# Altium schematic sheet Schematic.SchDoc
size A4; SheetNumber: 1; SheetTotal: 1
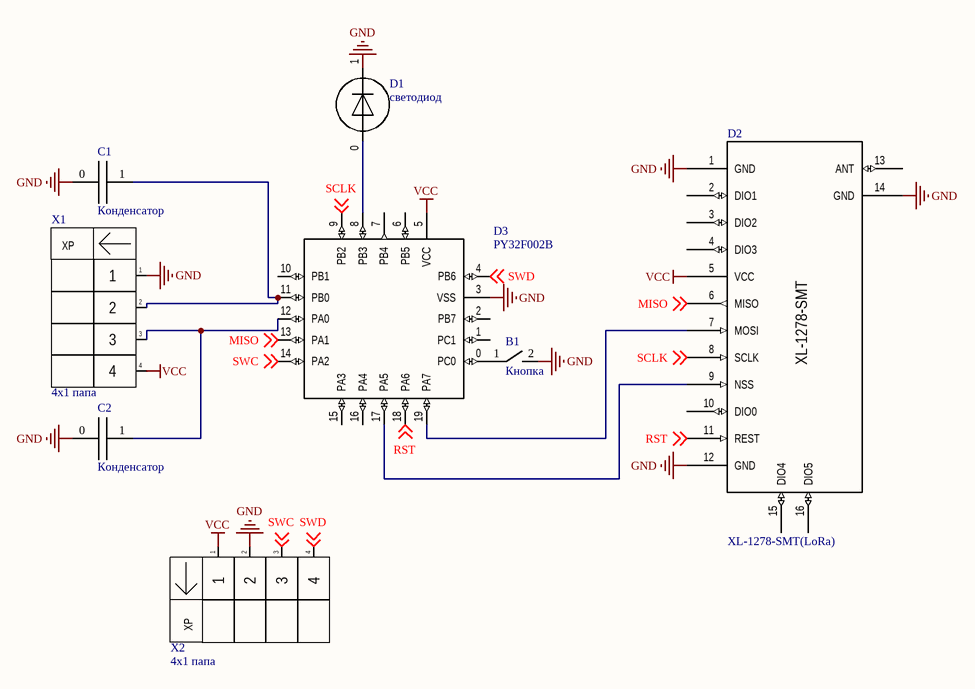
[diagram p0: Schematic.SchDoc]

## Parts
B1  Кнопка  [Button]
C1  Конденсатор  [0603 cap]
C2  Конденсатор  [0603 cap]
D1  светодиод  [0402 res]
D2  XL-1278-SMT(LoRa)  [SX1278_V1.2]
D3  PY32F002B  [TSSOP20]
X1  4х1 папа  [NEMA17 разъём]
X2  4х1 папа  [NEMA17 разъём]

## Nets
GND: B1.2 C1.0 C2.0 D1.1 D2.1(GND) D2.12(GND) D2.14(GND) D3.3(VSS) X1.1 X2.2
VCC: D2.5(VCC) D3.5(VCC) X1.4 X2.1
MISO: D2.6(MISO) D3.13(PA1) ; off-sheet MISO
RST: D2.11(REST) D3.18(PA6) ; off-sheet RST
SCLK: D2.8(SCLK) D3.9(PB2) ; off-sheet SCLK
SWC: D3.14(PA2) X2.3 ; off-sheet SWC
SWD: D3.4(PB6) X2.4 ; off-sheet SWD
NetB1_1: B1.1 D3.0(PC0)
NetC1_1: C1.1 D3.11(PB0) X1.2
NetC2_1: C2.1 D3.12(PA0) X1.3
NetD1_0: D1.0 D3.8(PB3)
NetD2_7: D2.7(MOSI) D3.19(PA7)
NetD2_9: D2.9(NSS) D3.17(PA5)

Not connected (* = marked no-connect by the designer): D2 2(DIO1) 3(DIO2) 4(DIO3) 10(DIO0) 13(ANT) 15(DIO4) 16(DIO5); D3 1(PC1) 2(PB7) 6(PB5) 7(PB4) 10(PB1) 15(PA3) 16(PA4)

## Notes on the sheet
- (in symbol 4х1 папа) XP
- (in symbol XL-1278-SMT(LoRa)) XL-1278-SMT

## Library data of the parts
D2 = XL-1278-SMT(LoRa): Радиомодуль
D3 = PY32F002B: МК
X1 X2 = 4х1 папа: Разъём